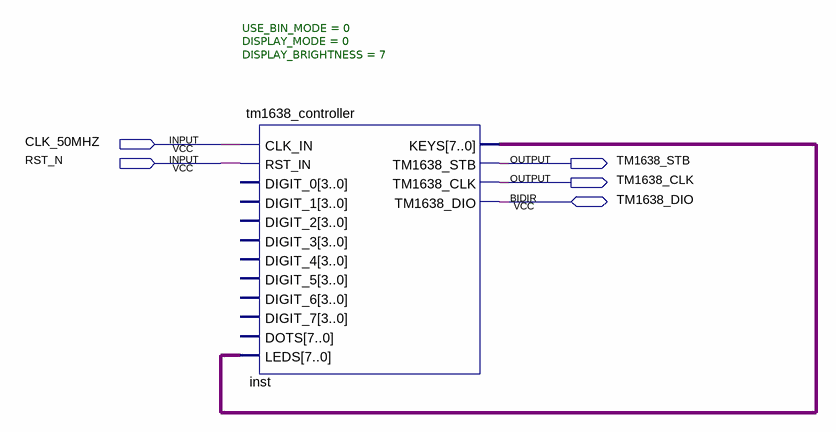
[diagram p0: schematic sheet]
// Quartus schematic TM1638_BLOCK.bdf as structural Verilog: 1 symbols, 5 pins
module TM1638_BLOCK (
  input  CLK_50MHZ,
  input  RST_N,
  inout  TM1638_DIO,
  output TM1638_STB,
  output TM1638_CLK
);

  wire [7:0] inst_keys;

  tm1638_controller #(.USE_BIN_MODE(0), .DISPLAY_MODE(0), .DISPLAY_BRIGHTNESS(7)) inst (
    .CLK_IN(CLK_50MHZ), .RST_IN(RST_N), .LEDS(inst_keys), .KEYS(inst_keys), .TM1638_STB(TM1638_STB),
    .TM1638_CLK(TM1638_CLK), .TM1638_DIO(TM1638_DIO));  // open: DIGIT_0, DIGIT_1, DIGIT_2, DIGIT_3, DIGIT_4, DIGIT_5, DIGIT_6, DIGIT_7, DOTS
endmodule
